# EAGLE schematic MicroOLEDWithKL02-r2 (EAGLE 6.5.0)
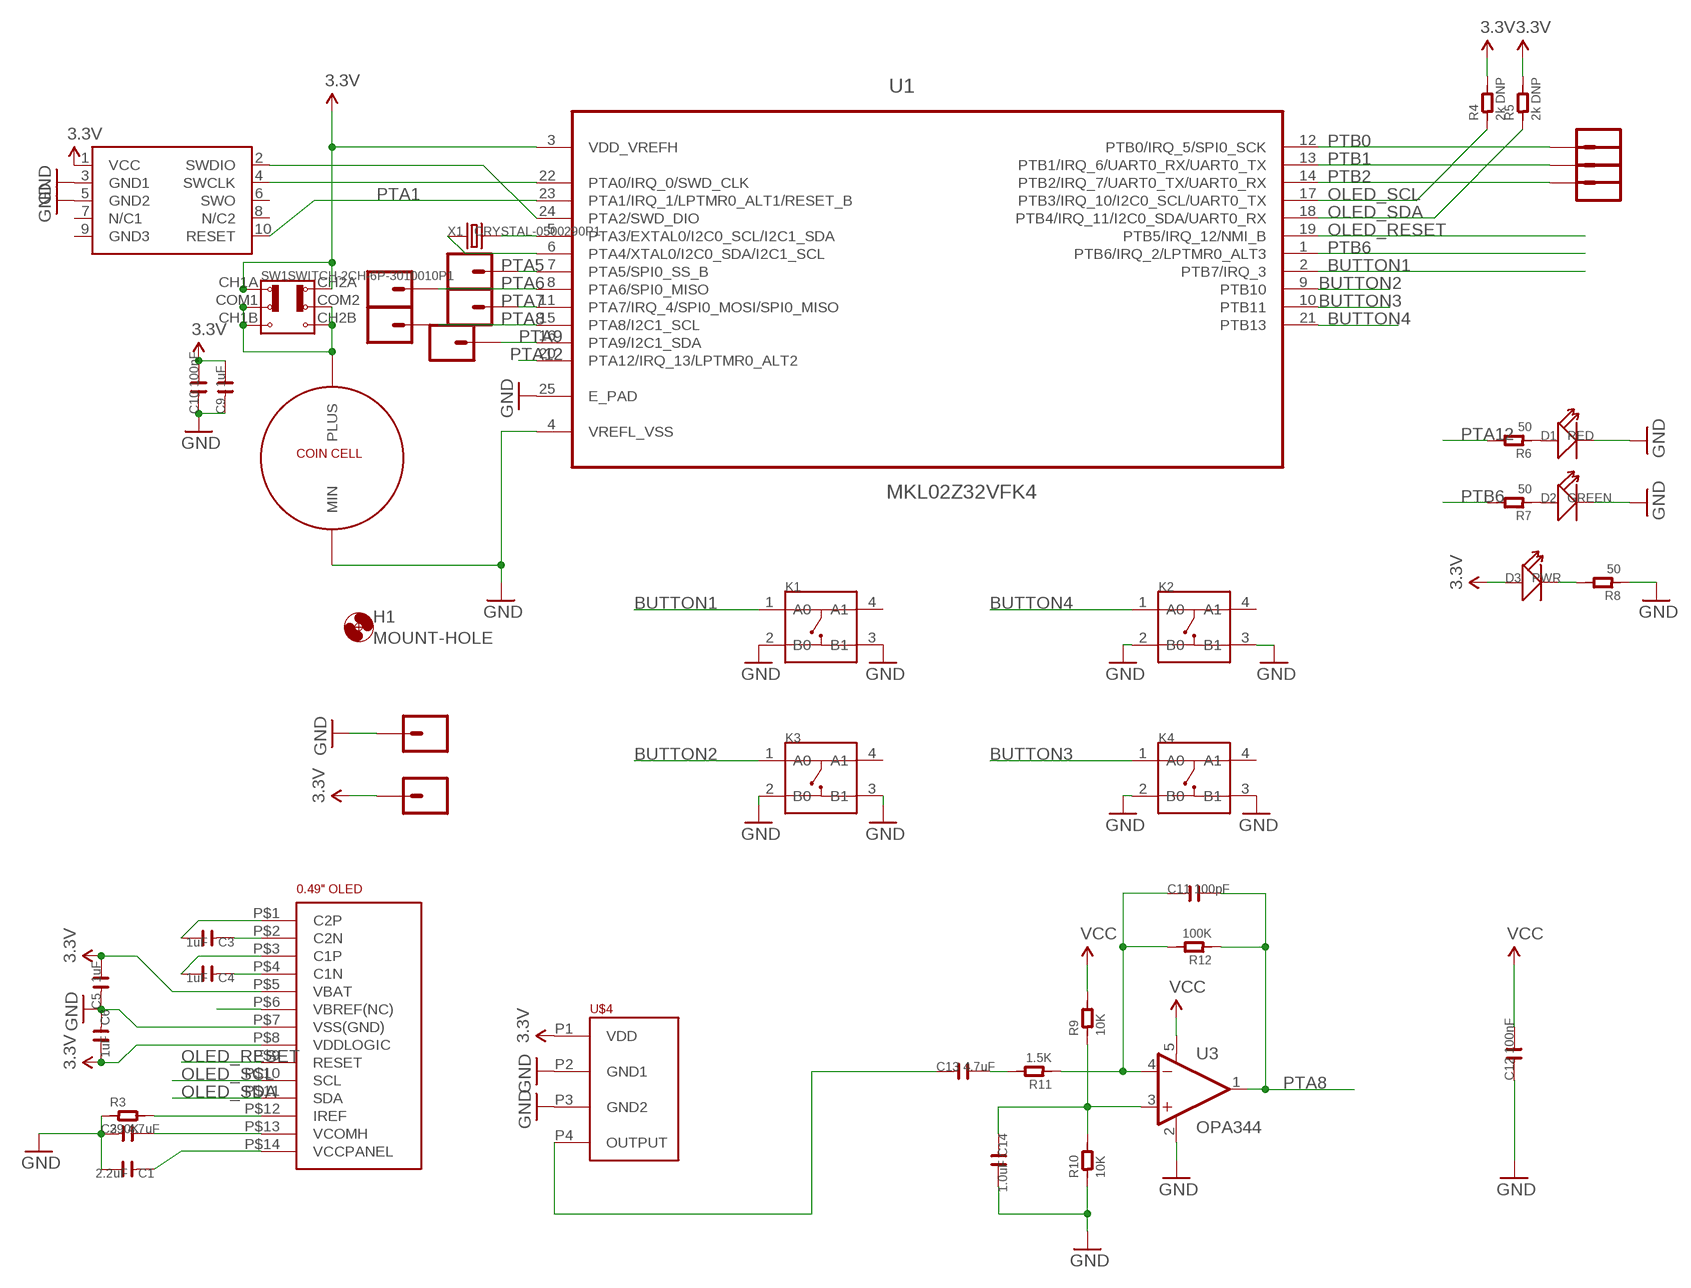
[diagram p0: schematic, sheet 1]

## Parts
C1  2.2uF  C-0603  [C0603]
C2  4.7uF  C-0603  [C0603]
C3  1uF  C-0603  [C0603]
C4  1uF  C-0603  [C0603]
C5  1uF  C-0603  [C0603]
C6  1uF  C-0603  [C0603]
C9  1uF  C-0603  [C0603]
C10  100nF  C-0603  [C0603]
C11  100pF  C-0603  [C0603]
C12  100nF  C-0603  [C0603]
C13  4.7uF  C-0603  [C0603]
C14  1.0uF  C-0603  [C0603]
D1  RED  LED  [LED0603]
D2  GREEN  LED  [LED0603]
D3  PWR  LED  [LED0603]
H1  MOUNT-HOLE  [3.2-NOMARKINGS-SMALLSAFEZONE]
K1  BUTTON-4P-3100010P1  [4P-SMD-6.0X6.0X5.0H]
K2  BUTTON-4P-3100010P1  [4P-SMD-6.0X6.0X5.0H]
K3  BUTTON-4P-3100010P1  [4P-SMD-6.0X6.0X5.0H]
K4  BUTTON-4P-3100010P1  [4P-SMD-6.0X6.0X5.0H]
PTA5_SS  M01SMD-4.5X1.5  [PAD-1.5X4.5]
PTA6_MISO  M01SMD-4.5X1.5  [PAD-1.5X4.5]
PTA7_MOSI_MISO  M01SMD-4.5X1.5  [PAD-1.5X4.5]
PTA8_I2C1_SCL  M01SMD-4.5X1.5  [PAD-1.5X4.5]
PTA9_I2C1_SDA  M01SMD-4.5X1.5  [PAD-1.5X4.5]
PTB0_SCK  M01SMD-4.5X1.5  [PAD-1.5X4.5]
PTB1_RXTX  M01SMD-4.5X1.5  [PAD-1.5X4.5]
PTB2_TXRX  M01SMD-4.5X1.5  [PAD-1.5X4.5]
PTB2_TXRX1  M01SMD-4.5X1.5  [PAD-1.5X4.5]
PTB2_TXRX2  M01SMD-4.5X1.5  [PAD-1.5X4.5]
R3  390K  R-0603  [R0603]
R4  2k DNP  R-0603  [R0603]
R5  2k DNP  R-0603  [R0603]
R6  50  R-0603  [R0603]
R7  50  R-0603  [R0603]
R8  50  R-0603  [R0603]
R9  10K  R-0603  [R0603]
R10  10K  R-0603  [R0603]
R11  1.5K  R-0603  [R0603]
R12  100K  R-0603  [R0603]
SW1  SWITCH-2CH-6P-3010010P1  [6P-2CH-2.54-9.1X3.5X3.2+2H]
SWD1  CORTEX_SWD  [M50-3600542]
U1  MKL02Z32VFK4  [QFN50P400X400X100-25N]
U3  OPA344  [SOT23-5]
U$1  0.49"OLED  [FPC-0.7-14]
U$4  WM7120A  [LGAMS4]
U$5  COINCELL  [2032HOLDER-SZ]
X1  CRYSTAL-0500290P1  [2P-SMD-5.0X3.2]

## Nets
3.3V: C5.2 C6.2 C9.2 C10.2 C12.2 D3.+ PTB2_TXRX1.P$1 R4.2 R5.2 R9.2 SW1.CH1A SW1.CH2A SWD1.1(VCC) U1.3(VDD_VREFH) U3.5(V+) U$1.P$5(VBAT) U$1.P$8(VDDLOGIC) U$4.P1(VDD) ; supply symbol labelled VCC
BUTTON1: K1.1(A0) U1.2(PTB7/IRQ_3)
BUTTON2: K3.1(A0) U1.9(PTB10)
BUTTON3: K4.1(A0) U1.10(PTB11)
BUTTON4: K2.1(A0) U1.21(PTB13)
GND: C1.2 C2.1 C5.1 C6.1 C9.1 C10.1 C12.1 C14.2 D1.- D2.- K1.2(B0) K1.3(B1) K2.2(B0) K2.3(B1) K3.2(B0) K3.3(B1) K4.2(B0) K4.3(B1) PTB2_TXRX2.P$1 R3.1 R8.1 R10.1 SWD1.3(GND1) SWD1.5(GND2) U1.4(VREFL_VSS) U1.25(E_PAD) U3.2(V-) U$1.P$7(VSS(GND)) U$4.P2(GND1) U$4.P3(GND2) U$5.MIN
N$1: U1.5(PTA3/EXTAL0/I2C0_SCL/I2C1_SDA) X1.2
N$2: U1.6(PTA4/XTAL0/I2C0_SDA/I2C1_SCL) X1.1
N$3: C3.2 U$1.P$1(C2P)
N$4: C4.2 U$1.P$3(C1P)
N$5: SWD1.4(SWCLK) U1.22(PTA0/IRQ_0/SWD_CLK)
N$6: D1.+ R6.1
N$7: SWD1.2(SWDIO) U1.24(PTA2/SWD_DIO)
N$8: U$1.P$6(VBREF(NC))
N$9: R3.2 U$1.P$12(IREF)
N$10: C1.1 U$1.P$14(VCCPANEL)
N$11: C2.2 U$1.P$13(VCOMH)
N$12: C3.1 U$1.P$2(C2N)
N$13: C4.1 U$1.P$4(C1N)
N$14: D2.+ R7.1
N$15: C13.1 U$4.P4(OUTPUT)
N$16: C11.1 R11.1 R12.2 U3.4(-IN)
N$17: C13.2 R11.2
N$18: C14.1 R9.1 R10.2 U3.3(+IN)
N$19: D3.- R8.2
N$20: SW1.CH1B SW1.CH2B SW1.COM1 SW1.COM2 U$5.PLUS
OLED_RESET: U1.19(PTB5/IRQ_12/NMI_B) U$1.P$9(RESET)
OLED_SCL: R4.1 U1.17(PTB3/IRQ_10/I2C0_SCL/UART0_TX) U$1.P$10(SCL)
OLED_SDA: R5.1 U1.18(PTB4/IRQ_11/I2C0_SDA/UART0_RX) U$1.P$11(SDA)
PTA1: SWD1.10(RESET) U1.23(PTA1/IRQ_1/LPTMR0_ALT1/RESET_B)
PTA5: PTA5_SS.P$1 U1.7(PTA5/SPI0_SS_B)
PTA6: PTA6_MISO.P$1 U1.8(PTA6/SPI0_MISO)
PTA7: PTA7_MOSI_MISO.P$1 U1.11(PTA7/IRQ_4/SPI0_MOSI/SPI0_MISO)
PTA8: C11.2 PTA8_I2C1_SCL.P$1 R12.1 U1.15(PTA8/I2C1_SCL) U3.1(OUT)
PTA9: PTA9_I2C1_SDA.P$1 U1.16(PTA9/I2C1_SDA)
PTA12: R6.2 U1.20(PTA12/IRQ_13/LPTMR0_ALT2)
PTB0: PTB0_SCK.P$1 U1.12(PTB0/IRQ_5/SPI0_SCK)
PTB1: PTB1_RXTX.P$1 U1.13(PTB1/IRQ_6/UART0_RX/UART0_TX)
PTB2: PTB2_TXRX.P$1 U1.14(PTB2/IRQ_7/UART0_TX/UART0_RX)
PTB6: R7.2 U1.1(PTB6/IRQ_2/LPTMR0_ALT3)
Unconnected: K1.4(A1) K2.4(A1) K3.4(A1) K4.4(A1) SWD1.6(SWO) SWD1.7(N/C1) SWD1.8(N/C2) SWD1.9(GND3)

## Library data of the parts
C1-C6 C9-C14 = OPL:C*
D1-D3 = OPL:LED*: LED
H1 = zephod-components:MOUNT-HOLE: MOUNTING HOLE with drill center marker
K1-K4 = zephod-components:BUTTON-4P
PTA5_SS PTA6_MISO PTA7_MOSI_MISO PTA8_I2C1_SCL PTA9_I2C1_SDA PTB0_SCK PTB1_RXTX PTB2_TXRX PTB2_TXRX1 PTB2_TXRX2 = SparkFun-Connectors:M01: Header 1 Standard 1-pin 0.1" header. Use with straight break away headers (SKU : PRT-00116), right angle break away headers (PRT-00553), swiss pins (PRT-00743), machine pins (PRT-00117), and female headers (PRT-00115).
R3-R12 = OPL:R*
SW1 = zephod-components:SWITCH-2CH-6P*: MS-22D18 G2 ROHS
SWD1 = carrilib with jtags:CORTEX_SWD: .05" Cortex M Connector in SWD mode Manufacturer: Generic Part Number: Cortex M SWD Notes: I use Harwin M50-3600542 connectors
U1 = FarnellThings:MKL02Z32VFK4: IC, MCU, 32BIT, CORTEX M0+, 48MHZ, QFN-24; MPN: MKL02Z32VFK4; OC_FARNELL: 2321481; OC_NEWARK: 61W9887; PACKAGE: QFN-24; SUPPLIER: FREESCALE SEMICONDUCTOR
U3 = SparkFun:OPA344
U$1 = zephod-tft:0.49"OLED
U$4 = KL02Z:WM7120A
U$5 = BatteryHolder:COINCELL
X1 = OPL:CRYSTAL*